# Altium schematic sheet 04_ WSTK Connectors & Board ID.SchDoc: EFR32FG23 Diversity Board with discrete matching network for 868/915 MHz
size 420 x 297 mm; Doc: BRD4210B; OrgName: Silicon Labs; Page Number: 4; Page Title: WSTK Connectors & Board ID; Page Size: A3; Page Count: 4; Board Designer: MSZ; RevCode: A00; DsnPath: C:\Users\maszvobo\Downloads\BRD4210A-A01-schematic-dsn\BRD4210A.DSN; SchematicName: SCHEMATIC1; PageName: WSTK Connectors & Board ID; PageSize: A3; TopSchematic: True
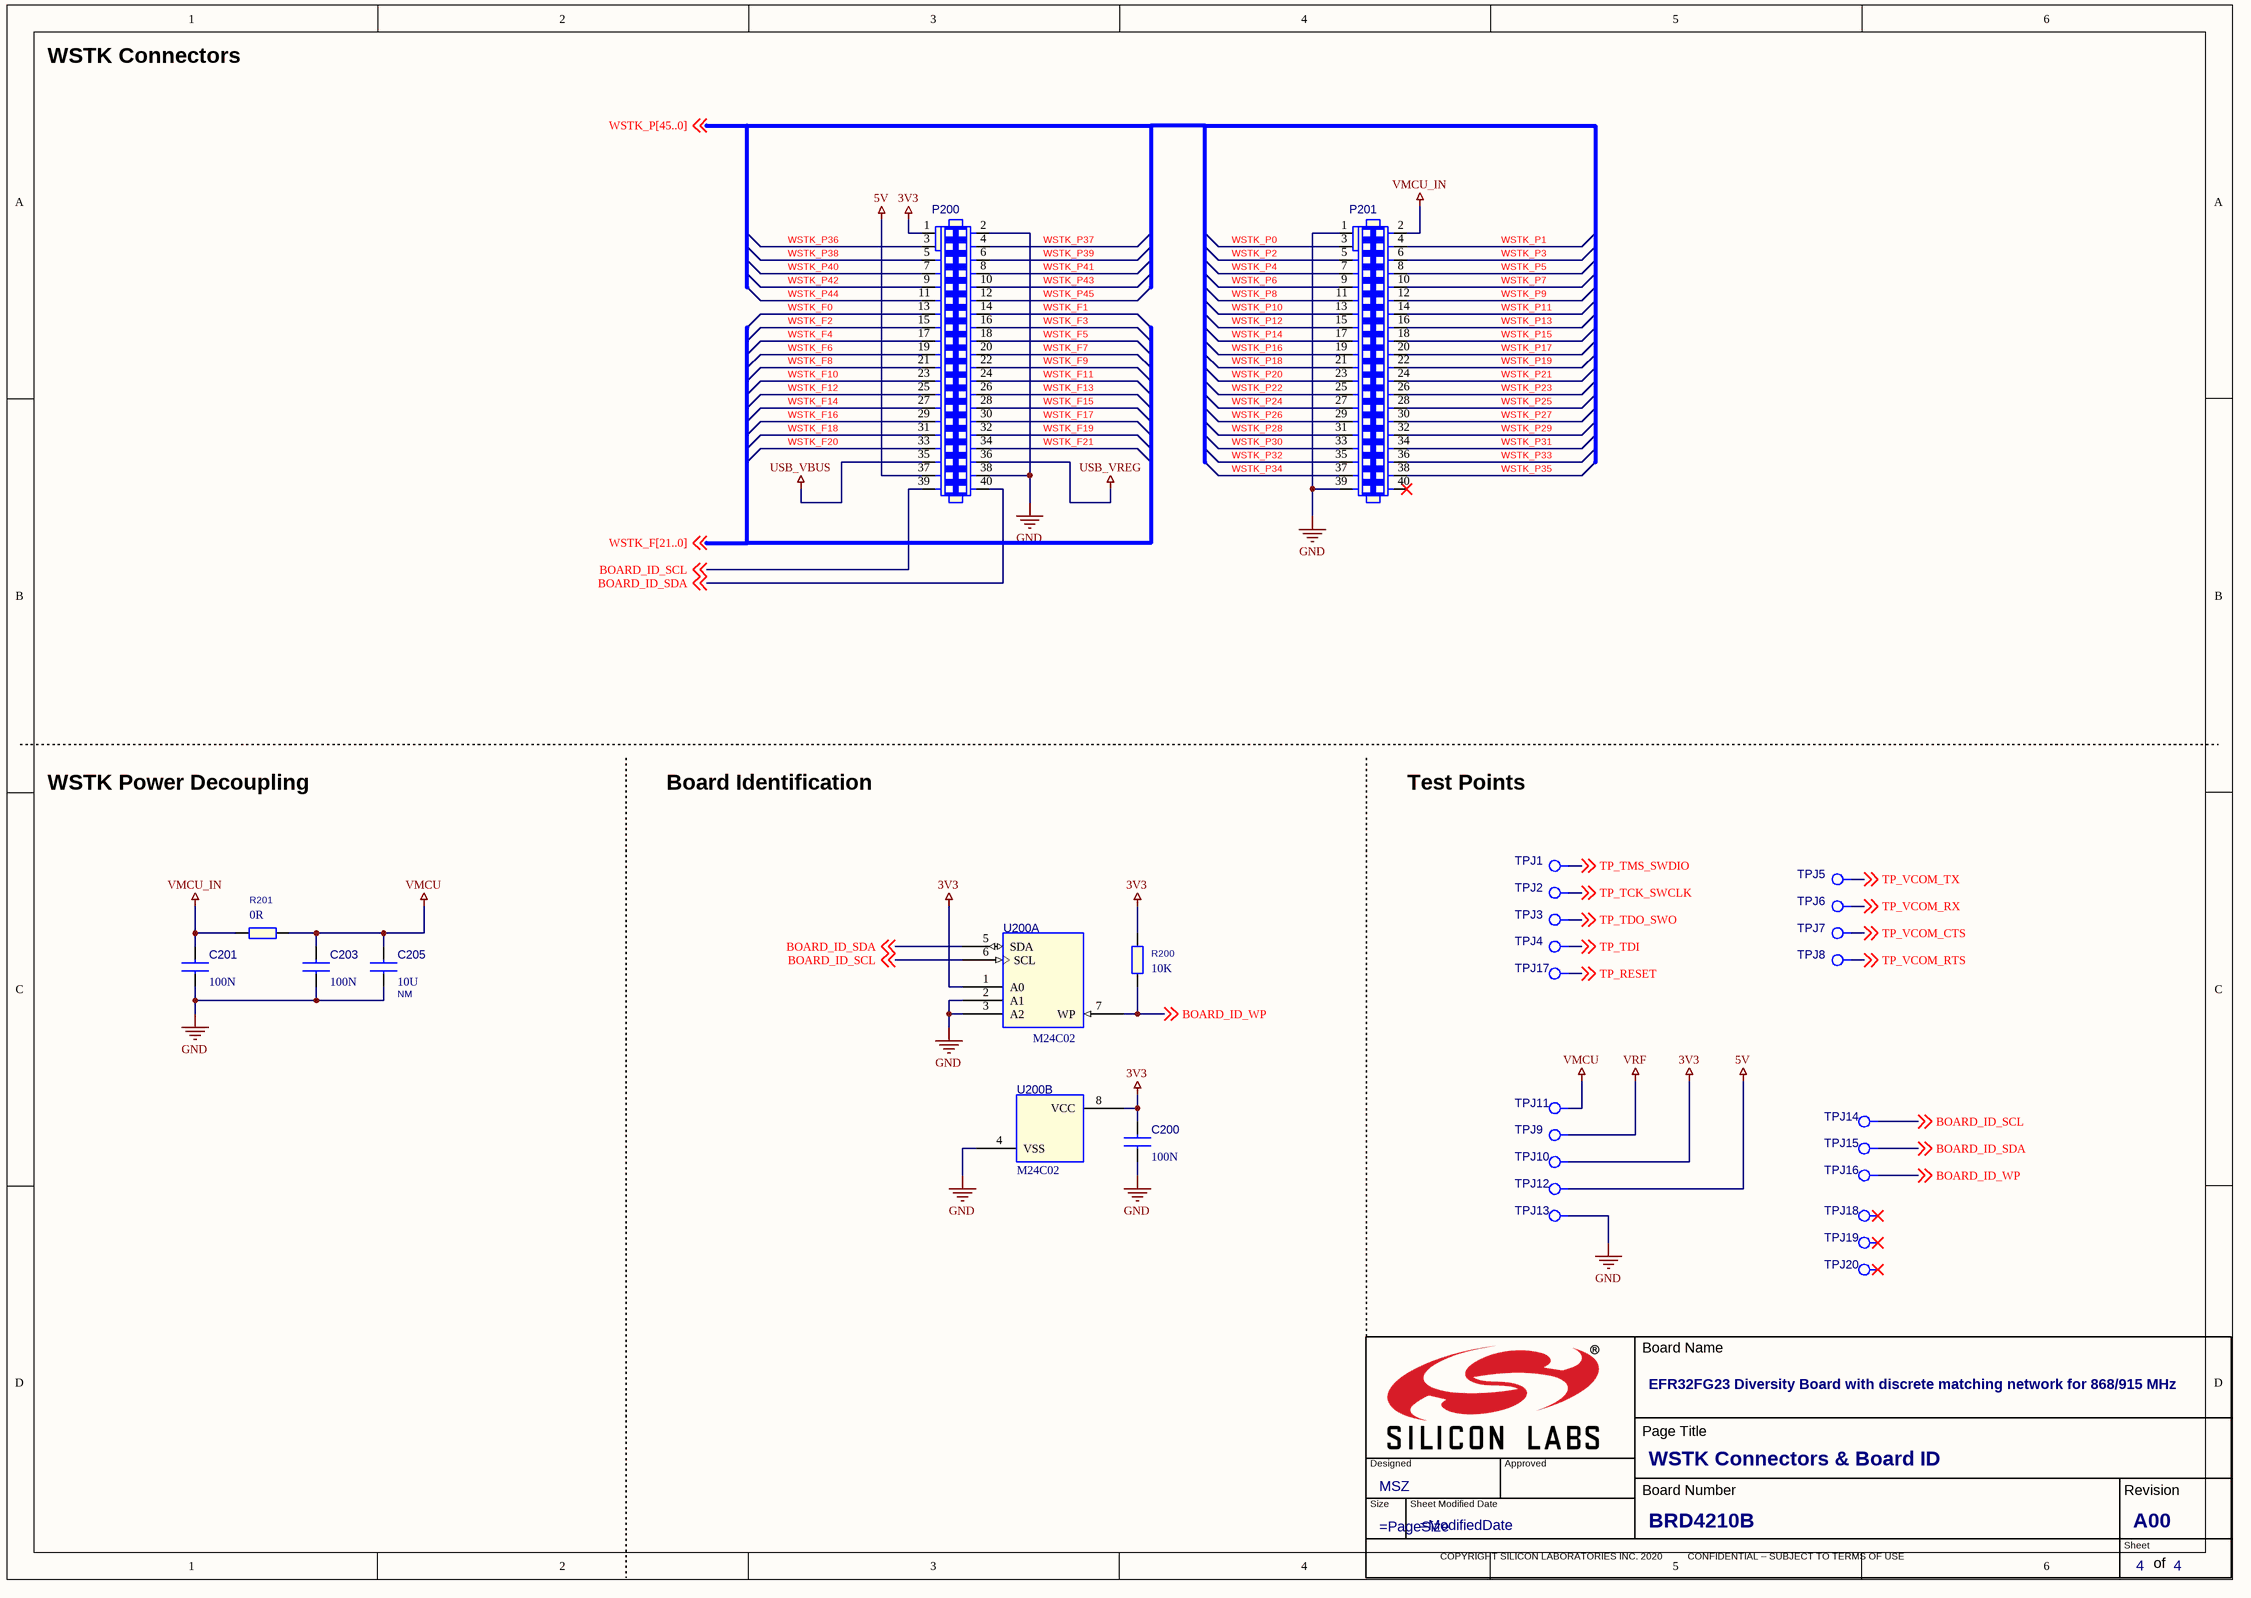
[diagram p0: 04_ WSTK Connectors & Board ID.SchDoc]

## Parts
*  Doc: BRD4210B  RevCode: A00  Board Designer: MSZ  Page Title: WSTK Connectors & Board ID  Page Number: 4  Title: EFR32FG23 Diversity Board with discrete matching network for 868/915 MHz  (graphical)
C200  100N  [C0201_L]
C201  100N  [C0201_L]
C203  100N  [C0201_L]
C205  10U  Not Mounted: NM  [T_UNDEF]
P200  SOCKET_WCON_2X20_1.27MM_SMD  [SAM_SFC-120-T2-D-A-2X20_SNUM]  (value not drawn)
P201  SOCKET_WCON_2X20_1.27MM_SMD  [SAM_SFC-120-T2-D-A-2X20_SNUM]  (value not drawn)
R200  10K  [R0201_L]
R201  0R  [T_UNDEF]
TPJ1  TPJ_SMD  [TP_1.0_SMD]  (value not drawn)
TPJ2  TPJ_SMD  [TP_1.0_SMD]  (value not drawn)
TPJ3  TPJ_SMD  [TP_1.0_SMD]  (value not drawn)
TPJ4  TPJ_SMD  [TP_1.0_SMD]  (value not drawn)
TPJ5  TPJ_SMD  [TP_1.0_SMD]  (value not drawn)
TPJ6  TPJ_SMD  [TP_1.0_SMD]  (value not drawn)
TPJ7  TPJ_SMD  [TP_1.0_SMD]  (value not drawn)
TPJ8  TPJ_SMD  [TP_1.0_SMD]  (value not drawn)
TPJ9  TPJ_SMD  [TP1MM_SMD]  (value not drawn)
TPJ10  TPJ_SMD  [TP1MM_SMD]  (value not drawn)
TPJ11  TPJ_SMD  [TP1MM_SMD]  (value not drawn)
TPJ12  TPJ_SMD  [TP1MM_SMD]  (value not drawn)
TPJ13  TPJ_SMD  [TP1MM_SMD]  (value not drawn)
TPJ14  TPJ_SMD  [TP1MM_SMD]  (value not drawn)
TPJ15  TPJ_SMD  [TP1MM_SMD]  (value not drawn)
TPJ16  TPJ_SMD  [TP1MM_SMD]  (value not drawn)
TPJ17  TPJ_SMD  [TP_1.0_SMD]  (value not drawn)
TPJ18  TPJ_SMD  [TP1MM_SMD]  (value not drawn)
TPJ19  TPJ_SMD  [TP1MM_SMD]  (value not drawn)
TPJ20  TPJ_SMD  [TP1MM_SMD]  (value not drawn)
U200  M24C02  [TDFN8_M050_2.0X3.0_EP]  (parts A,B of 2)

## Nets
3V3: C200.1 P200.1 R200.2 TPJ10.1(TP) U200.1(A0) U200.8(VCC)
5V: P200.37 TPJ12.1(TP)
GND: C200.2 C201.2 C203.2 C205.2 P200.2 P200.38 P201.1 P201.39 TPJ13.1(TP) U200.2(A1) U200.3(A2) U200.4(VSS)
USB_VBUS: P200.35
USB_VREG: P200.36
VMCU: C203.1 C205.1 R201.2 TPJ11.1(TP)
VMCU_IN: C201.1 P201.2 R201.1
VRF: TPJ9.1(TP)
BOARD_ID_SCL: P200.39 TPJ14.1(TP) U200.6(SCL) ; off-sheet BOARD_ID_SCL
BOARD_ID_SDA: P200.40 TPJ15.1(TP) U200.5(SDA) ; off-sheet BOARD_ID_SDA
BOARD_ID_WP: R200.1 TPJ16.1(TP) U200.7(WP) ; off-sheet BOARD_ID_WP
TP_RESET: TPJ17.1(TP) ; off-sheet TP_RESET
TP_TCK_SWCLK: TPJ2.1(TP) ; off-sheet TP_TCK_SWCLK
TP_TDI: TPJ4.1(TP) ; off-sheet TP_TDI
TP_TDO_SWO: TPJ3.1(TP) ; off-sheet TP_TDO_SWO
TP_TMS_SWDIO: TPJ1.1(TP) ; off-sheet TP_TMS_SWDIO
TP_VCOM_CTS: TPJ7.1(TP) ; off-sheet TP_VCOM_CTS
TP_VCOM_RTS: TPJ8.1(TP) ; off-sheet TP_VCOM_RTS
TP_VCOM_RX: TPJ6.1(TP) ; off-sheet TP_VCOM_RX
TP_VCOM_TX: TPJ5.1(TP) ; off-sheet TP_VCOM_TX
WSTK_F0: P200.13
WSTK_F1: P200.14
WSTK_F2: P200.15
WSTK_F3: P200.16
WSTK_F4: P200.17
WSTK_F5: P200.18
WSTK_F6: P200.19
WSTK_F7: P200.20
WSTK_F8: P200.21
WSTK_F9: P200.22
WSTK_F10: P200.23
WSTK_F11: P200.24
WSTK_F12: P200.25
WSTK_F13: P200.26
WSTK_F14: P200.27
WSTK_F15: P200.28
WSTK_F16: P200.29
WSTK_F17: P200.30
WSTK_F18: P200.31
WSTK_F19: P200.32
WSTK_F20: P200.33
WSTK_F21: P200.34
WSTK_P0: P201.3
WSTK_P1: P201.4
WSTK_P2: P201.5
WSTK_P3: P201.6
WSTK_P4: P201.7
WSTK_P5: P201.8
WSTK_P6: P201.9
WSTK_P7: P201.10
WSTK_P8: P201.11
WSTK_P9: P201.12
WSTK_P10: P201.13
WSTK_P11: P201.14
WSTK_P12: P201.15
WSTK_P13: P201.16
WSTK_P14: P201.17
WSTK_P15: P201.18
WSTK_P16: P201.19
WSTK_P17: P201.20
WSTK_P18: P201.21
WSTK_P19: P201.22
WSTK_P20: P201.23
WSTK_P21: P201.24
WSTK_P22: P201.25
WSTK_P23: P201.26
WSTK_P24: P201.27
WSTK_P25: P201.28
WSTK_P26: P201.29
WSTK_P27: P201.30
WSTK_P28: P201.31
WSTK_P29: P201.32
WSTK_P30: P201.33
WSTK_P31: P201.34
WSTK_P32: P201.35
WSTK_P33: P201.36
WSTK_P34: P201.37
WSTK_P35: P201.38
WSTK_P36: P200.3
WSTK_P37: P200.4
WSTK_P38: P200.5
WSTK_P39: P200.6
WSTK_P40: P200.7
WSTK_P41: P200.8
WSTK_P42: P200.9
WSTK_P43: P200.10
WSTK_P44: P200.11
WSTK_P45: P200.12

Not connected (* = marked no-connect by the designer): P201 40*; TPJ18 1(TP)*; TPJ19 1(TP)*; TPJ20 1(TP)*

## Notes on the sheet
- WSTK Connectors
- WSTK Power Decoupling
- Board Identification
- Test Points
- (in symbol TitleBlock_SiliconLabs_A3) Board Name; Page Title; Designed; Approved; Board Number; Revision; Size; Sheet Modified Date; Sheet; COPYRIGHT SILICON LABORATORIES INC. 2020          CONFIDENTIAL – SUBJECT TO TERMS OF USE; of

## Library data of the parts
* = TitleBlock_SiliconLabs_A3: Page Size: =PageSize; Page Count: 4; Page Modify Date: =ModifiedDate; OrgName: Silicon Labs
C200 = C0201: Part Reference: C200; Tolerance: 20%; Rating: 16V; Technology: X7S; Value: 100N; PCB Footprint: C0201_L
C201 = C0201: Part Reference: C201; Tolerance: 20%; Rating: 16V; Technology: X7S; Value: 100N; PCB Footprint: C0201_L
C203 = C0201: Part Reference: C203; Tolerance: 20%; Rating: 16V; Technology: X7S; Value: 100N; PCB Footprint: C0201_L
C205 = CAPACITOR: Part Reference: C205; PCB Footprint: C0805_L; Technology: X5R; Value: 10U
P200 = SOCKET_WCON_2X20_1.27MM_SMD: Part Reference: P200; Mfg #: 2344-220MS3CUNR6; Mfg: WCON; Price_1K: 3.44; Value: SOCKET_WCON_2X20_1.27MM_SMD; PCB Footprint: SAM_SFC-120-T2-D-A-2X20_SNUM
P201 = SOCKET_WCON_2X20_1.27MM_SMD: Part Reference: P201; Mfg #: 2344-220MS3CUNR6; Mfg: WCON; Price_1K: 3.44; Value: SOCKET_WCON_2X20_1.27MM_SMD; PCB Footprint: SAM_SFC-120-T2-D-A-2X20_SNUM
R200 = R0201: Part Reference: R200; Price_1K: 0.005; Value: 10K; PCB Footprint: R0201_L
R201 = RESISTOR: Part Reference: R201; PCB Footprint: R0402_L; Price_1K: 0.005; Value: 0R
TPJ1 = TPJ_SMD_Dup1: Part Reference: TPJ1; PCB Footprint: TP_1.0_SMD
TPJ2 = TPJ_SMD_Dup1: Part Reference: TPJ2; PCB Footprint: TP_1.0_SMD
TPJ3 = TPJ_SMD_Dup1: Part Reference: TPJ3; PCB Footprint: TP_1.0_SMD
TPJ4 = TPJ_SMD_Dup1: Part Reference: TPJ4; PCB Footprint: TP_1.0_SMD
TPJ5 = TPJ_SMD_Dup1: Part Reference: TPJ5; PCB Footprint: TP_1.0_SMD
TPJ6 = TPJ_SMD_Dup1: Part Reference: TPJ6; PCB Footprint: TP_1.0_SMD
TPJ7 = TPJ_SMD_Dup1: Part Reference: TPJ7; PCB Footprint: TP_1.0_SMD
TPJ8 = TPJ_SMD_Dup1: Part Reference: TPJ8; PCB Footprint: TP_1.0_SMD
TPJ9 = TPJ_SMD: Part Reference: TPJ9; PCB Footprint: TP_1.0_SMD
TPJ10 = TPJ_SMD: Part Reference: TPJ10; PCB Footprint: TP_1.0_SMD
TPJ11 = TPJ_SMD: Part Reference: TPJ11; PCB Footprint: TP_1.0_SMD
TPJ12 = TPJ_SMD: Part Reference: TPJ12; PCB Footprint: TP_1.0_SMD
TPJ13 = TPJ_SMD: Part Reference: TPJ13; PCB Footprint: TP_1.0_SMD
TPJ14 = TPJ_SMD: Part Reference: TPJ14; PCB Footprint: TP_1.0_SMD
TPJ15 = TPJ_SMD: Part Reference: TPJ15; PCB Footprint: TP_1.0_SMD
TPJ16 = TPJ_SMD: Part Reference: TPJ16; PCB Footprint: TP_1.0_SMD
TPJ17 = TPJ_SMD_Dup1: Part Reference: TPJ17; PCB Footprint: TP_1.0_SMD
TPJ18 = TPJ_SMD: Part Reference: TPJ18; PCB Footprint: TP_1.0_SMD
TPJ19 = TPJ_SMD: Part Reference: TPJ19; PCB Footprint: TP_1.0_SMD
TPJ20 = TPJ_SMD: Part Reference: TPJ20; PCB Footprint: TP_1.0_SMD
U200 = M24C02: Part Reference: U200; Mfg #: M24C02-FMC6TG; Mfg: ST Microelectronics; CONTEC Footprint: MSOP8_M065_W3.0; Price_1K: 0.06; Value: M24C02; PCB Footprint: TDFN8_M050_2.0X3.0_EP